# EAGLE schematic MCU board ATmega328p v2.4 (SN) (EAGLE 9.2.1)
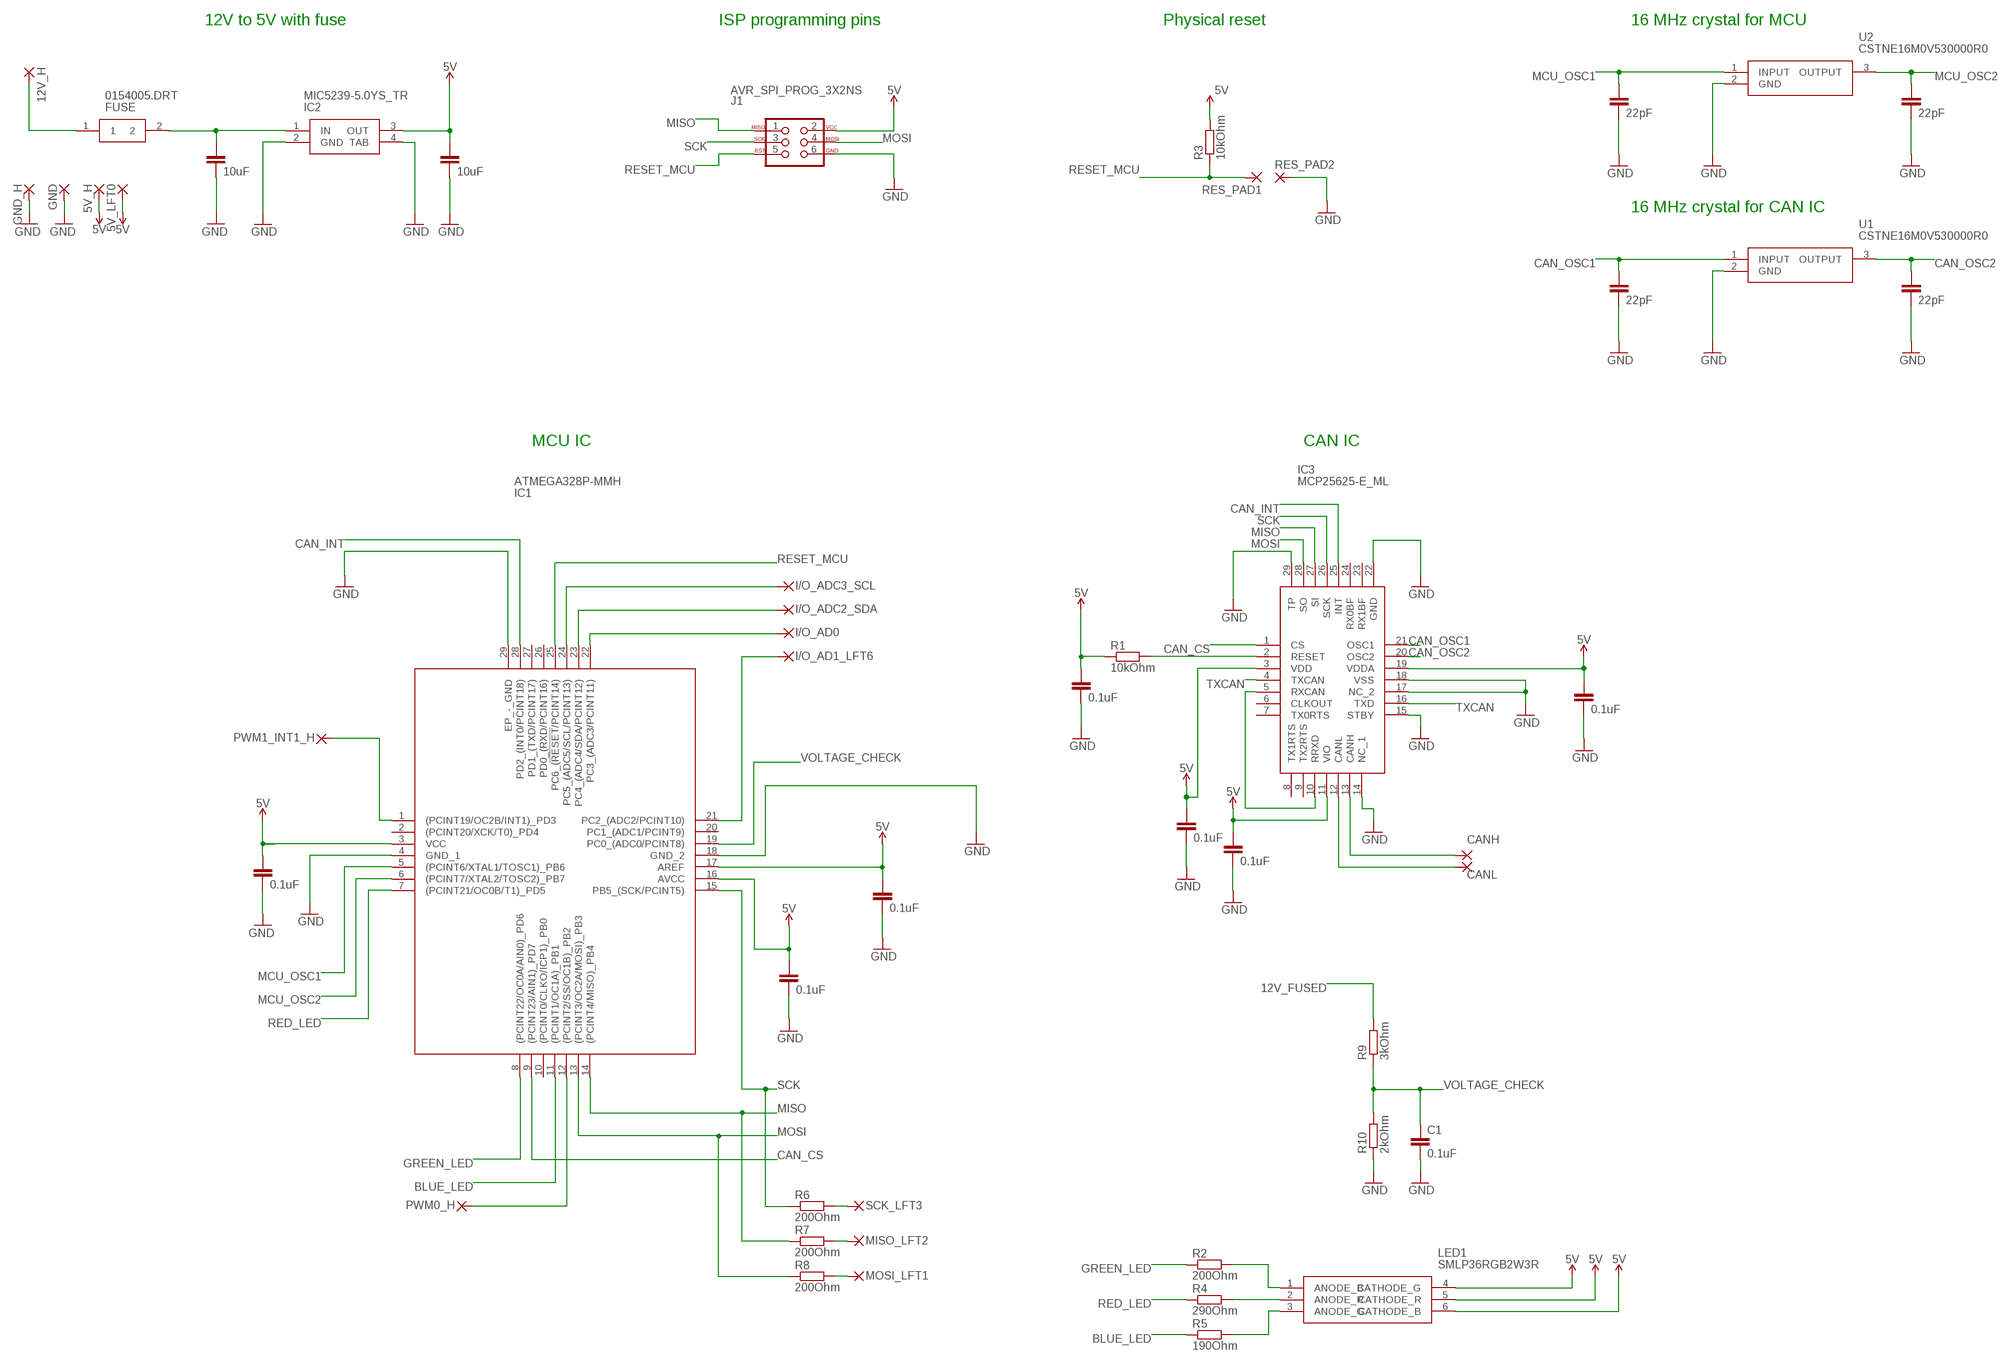
[diagram p0: schematic, sheet 1]

## Parts
5V  5V_H  2,15/1,0  [2,15/1,0]
5V1  5V_LFT0  2,15/1,0  [2,15/1,0]
12V_H  12V  2,15/1,0  [2,15/1,0]
C1  0.1uF  CC0603  [C0603]
C2  22pF  CC0603  [C0603]
C3  22pF  CC0603  [C0603]
C5  22pF  CC0603  [C0603]
C6  0.1uF  CC0603  [C0603]
C7  0.1uF  CC0603  [C0603]
C8  0.1uF  CC0603  [C0603]
C9  22pF  CC0603  [C0603]
C10  10uF  CC0603  [C0603]
C11  10uF  CC0603  [C0603]
C12  0.1uF  CC0603  [C0603]
C13  0.1uF  CC0603  [C0603]
C16  0.1uF  CC0603  [C0603]
C17  0.1uF  CC0603  [C0603]
CANH  I/O_CANH_H  2,15/1,0  [2,15/1,0]
CANL  I/O_CANH_H  2,15/1,0  [2,15/1,0]
FUSE  0154005.DRT  [0154001.DRT]
GND  GND_H  2,15/1,0  [2,15/1,0]
GND30_H  GND  2,15/1,0  [2,15/1,0]
I/O_AD0  I/O_AD0_LFT7  2,15/1,0  [2,15/1,0]
I/O_AD1  I/O_AD1_LFT6  2,15/1,0  [2,15/1,0]
I/O_ADC2_SDA  I/O_ADC2_SDA_LFT5  2,15/1,0  [2,15/1,0]
I/O_ADC3_SCL  I/O_ADC3_SCL_LFT4  2,15/1,0  [2,15/1,0]
IC1  ATMEGA328P-MMH  [QFN45P400X400X100-29N]
IC2  MIC5239-5.0YS_TR  [SOT230P700X170-4N]
IC3  MCP25625-E_ML  [QFN65P600X600X100-29N]
J1  AVR_SPI_PROG_3X2NS  [2X3-NS]
LED1  SMLP36RGB2W3R  [ROHM-1510-(0604)]
MISO  MISO_LFT2  2,15/1,0  [2,15/1,0]
MOSI  MOSI_LFT1  2,15/1,0  [2,15/1,0]
PWM0_H  PWM0  2,15/1,0  [2,15/1,0]
PWM1_INT1_H  PWM0_INT  2,15/1,0  [2,15/1,0]
R1  10kOhm  RR0603  [R0603]
R2  200Ohm  RR0603  [R0603]
R3  10kOhm  RR0603  [R0603]
R4  290Ohm  RR0603  [R0603]
R5  190Ohm  RR0603  [R0603]
R6  200Ohm  RR0603  [R0603]
R7  200Ohm  RR0603  [R0603]
R8  200Ohm  RR0603  [R0603]
R9  3kOhm  RR0603  [R0603]
R10  2kOhm  RR0603  [R0603]
RES_PAD1  RES_PAD  SMD2  [SMD1,27-2,54]
RES_PAD2  RES_PAD2  SMD2  [SMD1,27-2,54]
SCK  SCK_LFT3  2,15/1,0  [2,15/1,0]
U1  CSTNE16M0V530000R0  [CSTNE16M0V530000R0]
U2  CSTNE16M0V530000R0  [CSTNE16M0V530000R0]

## Nets
5V: 5V1.1(P) 5V.1(P) C6.1 C7.1 C8.1 C11.1 C12.1 C13.1 C16.1 C17.1 IC1.3(VCC) IC1.16(AVCC) IC1.17(AREF) IC2.3(OUT) IC3.3(VDD) IC3.11(VIO) IC3.19(VDDA) J1.2 LED1.4(CATHODE_G) LED1.5(CATHODE_R) LED1.6(CATHODE_B) R1.1 R3.2
12V_FUSED: C10.1 FUSE.2 IC2.1(IN) R9.2
12V_UNFUSED: 12V_H.1(P) FUSE.1
BLUE_LED: IC1.11((PCINT1/OC1A)_PB1) R5.1
CAN_CS: IC1.9((PCINT23/AIN1)_PD7) IC3.1(CS)
CAN_INT: IC1.28(PD2_(INT0/PCINT18)) IC3.25(INT)
CAN_OSC1: C5.1 IC3.21(OSC1) U1.1(INPUT)
CAN_OSC2: C2.1 IC3.20(OSC2) U1.3(OUTPUT)
CANH: CANH.1(P) IC3.13(CANH)
CANL: CANL.1(P) IC3.12(CANL)
GND: C1.2 C2.2 C3.2 C5.2 C6.2 C7.2 C8.2 C9.2 C10.2 C11.2 C12.2 C13.2 C16.2 C17.2 GND30_H.1(P) GND.1(P) IC1.4(GND_1) IC1.18(GND_2) IC1.29(EP_-_GND) IC2.2(GND) IC2.4(TAB) IC3.14(NC_1) IC3.15(STBY) IC3.17(NC_2) IC3.18(VSS) IC3.22(GND) IC3.29(TP) J1.6 R10.1 RES_PAD2.1(P) U1.2(GND) U2.2(GND)
GREEN_LED: IC1.8((PCINT22/OC0A/AIN0)_PD6) R2.1
I/O_ADC3: I/O_ADC3_SCL.1(P) IC1.24(PC5_(ADC5/SCL/PCINT13))
I/O_D2_INT: IC1.1((PCINT19/OC2B/INT1)_PD3) PWM1_INT1_H.1(P)
I/OAD0: I/O_AD0.1(P) IC1.22(PC3_(ADC3/PCINT11))
I/OADC2: I/O_ADC2_SDA.1(P) IC1.23(PC4_(ADC4/SDA/PCINT12))
MCU_OSC1: C3.1 IC1.5((PCINT6/XTAL1/TOSC1)_PB6) U2.1(INPUT)
MCU_OSC2: C9.1 IC1.6((PCINT7/XTAL2/TOSC2)_PB7) U2.3(OUTPUT)
MISO: IC1.14((PCINT4/MISO)_PB4) IC3.27(SI) J1.1 R7.1
MOSI: IC1.13((PCINT3/OC2A/MOSI)_PB3) IC3.28(SO) J1.4 R8.1
N$1: IC3.2(RESET) R1.2
N$2: IC1.12((PCINT2/SS/OC1B)_PB2) PWM0_H.1(P)
N$3: I/O_AD1.1(P) IC1.21(PC2_(ADC2/PCINT10))
N$4: LED1.1(ANODE_B) R2.2
N$8: LED1.2(ANODE_R) R4.2
N$9: LED1.3(ANODE_G) R5.2
N$10: R6.2 SCK.1(P)
N$11: MISO.1(P) R7.2
N$12: MOSI.1(P) R8.2
RED_LED: IC1.7((PCINT21/OC0B/T1)_PD5) R4.1
RESET_MCU: IC1.25(PC6_(!RESET!/PCINT14)) J1.5 R3.1 RES_PAD1.1(P)
RXCAN: IC3.5(RXCAN) IC3.10(RRXD)
SCK: IC1.15(PB5_(SCK/PCINT5)) IC3.26(SCK) J1.3 R6.1
TXCAN: IC3.4(TXCAN) IC3.16(TXD)
VOLTAGE_CHECK: C1.1 IC1.19(PC0_(ADC0/PCINT8)) R9.1 R10.2
Unconnected: IC1.2((PCINT20/XCK/T0)_PD4) IC1.10((PCINT0/CLKO/ICP1)_PB0) IC1.20(PC1_(ADC1/PCINT9)) IC1.26(PD0_(RXD/PCINT16)) IC1.27(PD1_(TXD/PCINT17)) IC3.6(CLKOUT) IC3.7(TX0RTS) IC3.8(TX1RTS) IC3.9(TX2RTS) IC3.23(RX1BF) IC3.24(RX0BF)

## Notes on the sheet
- 12V to 5V with fuse | ISP programming pins | Physical reset | 16 MHz crystal for MCU
- 16 MHz crystal for CAN IC
- MCU IC | CAN IC

## Library data of the parts
5V 5V1 12V_H CANH CANL GND GND30_H I/O_AD0 I/O_AD1 I/O_ADC2_SDA I/O_ADC3_SCL MISO MOSI PWM0_H PWM1_INT1_H SCK = wirepad:2,15/1,0: THROUGH-HOLE PAD
C1-C3 C5-C13 C16 C17 = eagle-ltspice:C: CAPACITOR, European symbol; SPICEMODEL: NONE; SPICEPREFIX: C
FUSE = 0154005(Fuseholder)DRT:0154005.DRT: Littelfuse 5A T Surface Mount Fuse, 125V ac/dc Source: Datasheet <http://www.littelfuse.com/~/media/electronics/datasheets/fuses/littelfuse_fuse_154_154t_154l_154tl_datasheet.pdf.pdf>; ALLIED_NUMBER: 70184875; ALLIED_PRICE-STOCK: https://www.alliedelec.com/littelfuse-0154005-drt/70184875/; ARROW_PART_NUMBER: 0154005.DRT; ARROW_PRICE-STOCK: https://www.arrow.com/en/products/0154005.drt/littelfuse; DESCRIPTION: Littelfuse 5A T Surface Mount Fuse, 125V ac/dc; HEIGHT: mm; MANUFACTURER_NAME: LITTELFUSE; MANUFACTURER_PART_NUMBER: 0154005.DRT; RS_PART_NUMBER: 2196260P; RS_PRICE-STOCK: http://uk.rs-online.com/web/p/products/2196260P
IC1 = ATMEGA328P-MMH:ATMEGA328P-MMH: Atmel ATMEGA328P-MMH, 8bit AVR Microcontroller, 20MHz, 32 kB Flash, 28-Pin QFN Source: Datasheet <http://uk.rs-online.com/web/p/products/8149138P>; ARROW_PART_NUMBER: ATMEGA328P-MMH; ARROW_PRICE-STOCK: https://www.arrow.com/en/products/atmega328p-mmh/microchip-technology; DESCRIPTION: Atmel ATMEGA328P-MMH, 8bit AVR Microcontroller, 20MHz, 32 kB Flash, 28-Pin QFN; HEIGHT: 1mm; MANUFACTURER_NAME: Microchip; MANUFACTURER_PART_NUMBER: ATMEGA328P-MMH; RS_PART_NUMBER: 1310272P; RS_PRICE-STOCK: http://uk.rs-online.com/web/p/products/1310272P
IC2 = MIC5239-5.0YS_TR:MIC5239-5.0YS_TR: LDO Regulator Pos 5V 0.5A Micrel MIC5239-5.0YS TR, LDO Voltage Regulator, 500mA, 5 V 1%, 2.3 30 Vin, 3 + Tab-Pin SOT-223 Source: Datasheet <http://ww1.microchip.com/downloads/en/DeviceDoc/mic5239.pdf>; ARROW_PART_NUMBER: MIC5239-5.0YS TR; ARROW_PRICE-STOCK: http://uk.rs-online.com/web/p/products/7275535P; DESCRIPTION: LDO Regulator Pos 5V 0.5A Micrel MIC5239-5.0YS TR, LDO Voltage Regulator, 500mA, 5 V 1%, 2.3 30 Vin, 3 + Tab-Pin SOT-223; HEIGHT: 1.7mm; MANUFACTURER_NAME: Micrel; MANUFACTURER_PART_NUMBER: MIC5239-5.0YS TR; RS_PART_NUMBER: 7275535P; RS_PRICE-STOCK: http://uk.rs-online.com/web/p/products/7275535P
IC3 = MCP25625-E_ML:MCP25625-E_ML: CAN Controller with Transceiver QFN28 Microchip MCP25625-E/ML, CAN Controller, 28-Pin QFN Source: Datasheet <http://docs-europe.electrocomponents.com/webdocs/137c/0900766b8137cddf.pdf>; ALLIED_NUMBER: 70431541; ALLIED_PRICE-STOCK: http://www.alliedelec.com/microchip-technology-inc-mcp25625-e-ml/70431541/; ARROW_PART_NUMBER: MCP25625-E/ML; ARROW_PRICE-STOCK: https://www.arrow.com/en/products/mcp25625-eml/microchip-technology; DESCRIPTION: CAN Controller with Transceiver QFN28 Microchip MCP25625-E/ML, CAN Controller, 28-Pin QFN; HEIGHT: 1mm; MANUFACTURER_NAME: Microchip; MANUFACTURER_PART_NUMBER: MCP25625-E/ML; RS_PART_NUMBER: 1654104; RS_PRICE-STOCK: http://uk.rs-online.com/web/p/products/1654104
J1 = SparkFun-Connectors:AVR_SPI_PROG_3X2: AVR ISP 6 Pin This is the reduced ISP connector for AVR programming. Common on Arduino. This footprint will take up less PCB space and can be used with a 10-pin to 6-pin adapter such as SKU: BOB-08508 **Special note about "TEST_POINT" package. The stop mask is on the top side, so if you want your programming test points to be on the bottom of your board, make sure to place this package on the bottom side of the board. This also ensure that the orientation to program from the bottom side will be correct. SparkFun Products: SparkFun ISP Pogo Adapter <https://www.sparkfun.com/products/11591> - NS Tiny AVR Programmer <https://www.sparkfun.com/products/11801> -PTH
LED1 = SMLP36RGB2W3R:SMLP36RGB2W3R: LED,RGB,35/110/35mcd,top-looking,1510 ROHM SMLP36RGB2W3R, SML-P36 Series 3 RGB LED, 475 (Blue) nm, 535 (Green) nm, 629 (Red) nm 6-Pin Milky White Source: Datasheet <http://www.rohm.com/web/global/datasheet/SMLP36RGB2W(R)>; ARROW_PART_NUMBER: SMLP36RGB2W3R; ARROW_PRICE-STOCK: https://www.arrow.com/en/products/smlp36rgb2w3r/rohm-semiconductor; DESCRIPTION: LED,RGB,35/110/35mcd,top-looking,1510 ROHM SMLP36RGB2W3R, SML-P36 Series 3 RGB LED, 475 (Blue) nm, 535 (Green) nm, 629 (Red) nm 6-Pin Milky White; HEIGHT: mm; MANUFACTURER_NAME: ROHM Semiconductor; MANUFACTURER_PART_NUMBER: SMLP36RGB2W3R; RS_PART_NUMBER: 1246884P; RS_PRICE-STOCK: http://uk.rs-online.com/web/p/products/1246884P
R1-R10 = eagle-ltspice:R: RESISTOR, European symbol; SPICEMODEL: NONE; SPICEPREFIX: R
RES_PAD1 RES_PAD2 = wirepad:SMD2: SMD PAD
U1 U2 = CSTNE16M0V530000R0:CSTNE16M0V530000R0: Resonators 16.0000MHz 15pF SMD CHP Resntr Source: Datasheet <https://www.murata.com/en-eu/products/productdata/8801162231838/SPEC-CSTNE16M0V530000R0.pdf?1519875007000>; ARROW_PART_NUMBER: CSTNE16M0V530000R0; ARROW_PRICE-STOCK: https://www.arrow.com/en/products/cstne16m0v530000r0/murata-manufacturing; DESCRIPTION: Resonators 16.0000MHz 15pF SMD CHP Resntr; HEIGHT: 1mm; MANUFACTURER_NAME: Murata Electronics; MANUFACTURER_PART_NUMBER: CSTNE16M0V530000R0